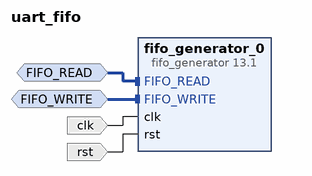
[diagram p0: block diagram of the top level]
# Vivado block design uart_fifo, xc7a35tcpg236-1, Vivado 2017.2
create_bd_design uart_fifo

create_bd_intf_port -mode Slave -vlnv xilinx.com:interface:fifo_read_rtl:1.0 FIFO_READ
create_bd_intf_port -mode Slave -vlnv xilinx.com:interface:fifo_write_rtl:1.0 FIFO_WRITE
create_bd_port -dir I -type clk clk
create_bd_port -dir I rst

create_bd_cell -type ip -vlnv xilinx.com:ip:fifo_generator:13.1 fifo_generator_0
set_property -dict [list \
  CONFIG.Fifo_Implementation Common_Clock_Builtin_FIFO \
  CONFIG.Input_Data_Width 8 \
  CONFIG.Input_Depth 4096 \
] [get_bd_cells fifo_generator_0]

# ---- connections ----

connect_bd_intf_net [get_bd_intf_ports FIFO_READ] [get_bd_intf_pins fifo_generator_0/FIFO_READ]
connect_bd_intf_net [get_bd_intf_ports FIFO_WRITE] [get_bd_intf_pins fifo_generator_0/FIFO_WRITE]
connect_bd_net [get_bd_ports clk] [get_bd_pins fifo_generator_0/clk]
connect_bd_net [get_bd_ports rst] [get_bd_pins fifo_generator_0/rst]

validate_bd_design
save_bd_design
